# EAGLE schematic LM386_amp_mic_mod (EAGLE 6.3)
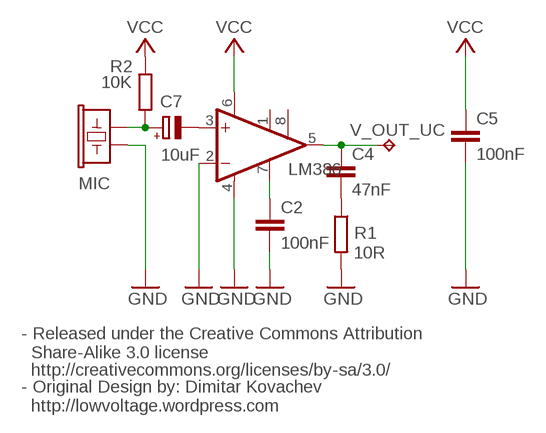
[diagram p0: schematic, sheet 1]

## Parts
C2  100nF  C-EU025-030X050  [C025-030X050]
C4  47nF  C-EU025-030X050  [C025-030X050]
C5  100nF  C-EU025-025X050  [C025-025X050]
C7  10uF  CPOL-EUE2.5-6  [E2,5-6]
LM386  LM386N-1  [DIL08]
MIC  MIC9.7MM  [MIC-9.7MM]
R1  10R  R-EU_0309/12  [0309/12]
R2  10K  R-EU_0309/12  [0309/12]
V_OUT_UC  TPB1,27  [B1,27]

## Nets
GND: C2.2 C5.2 LM386.2(-IN) LM386.4(GND) MIC.2 R1.2
N$1: C4.2 R1.1
N$2: C4.1 LM386.5(OUT) V_OUT_UC.TP
N$3: C2.1 LM386.7(BYPASS)
N$7: C7.+ MIC.1 R2.2
N$8: C7.- LM386.3(+IN)
VCC: C5.1 LM386.6(VS) R2.1
Unconnected: LM386.1(GAIN) LM386.8(GAIN)

## Notes on the sheet
- - Released under the Creative Commons Attribution
    Share-Alike 3.0 license
- http://creativecommons.org/licenses/by-sa/3.0/
- - Original Design by: Dimitar Kovachev
    http://lowvoltage.wordpress.com

## Library data of the parts
C2 C4 C5 = rcl:C-EU: CAPACITOR, European symbol
C7 = rcl:CPOL-EU: POLARIZED CAPACITOR, European symbol
LM386 = linear:LM386?-*: Low Voltage Audio Power Amplifier Source: http://cache.national.com/ds/LM/LM386.pdf
MIC = SparkFun:MIC: Microphone Omni-directional electret microphone. 9.7mm standard diameter.
R1 R2 = rcl:R-EU_: RESISTOR, European symbol
V_OUT_UC = testpad:TP: Test pad